# Altium schematic sheet Codec.SchDoc: Codec
size A4; DrawnBy: Brain-Yao; DocumentNumber: 2; Revision: 1.0; SheetNumber: 2; SheetTotal: 3; ProjectName: Stethoscope
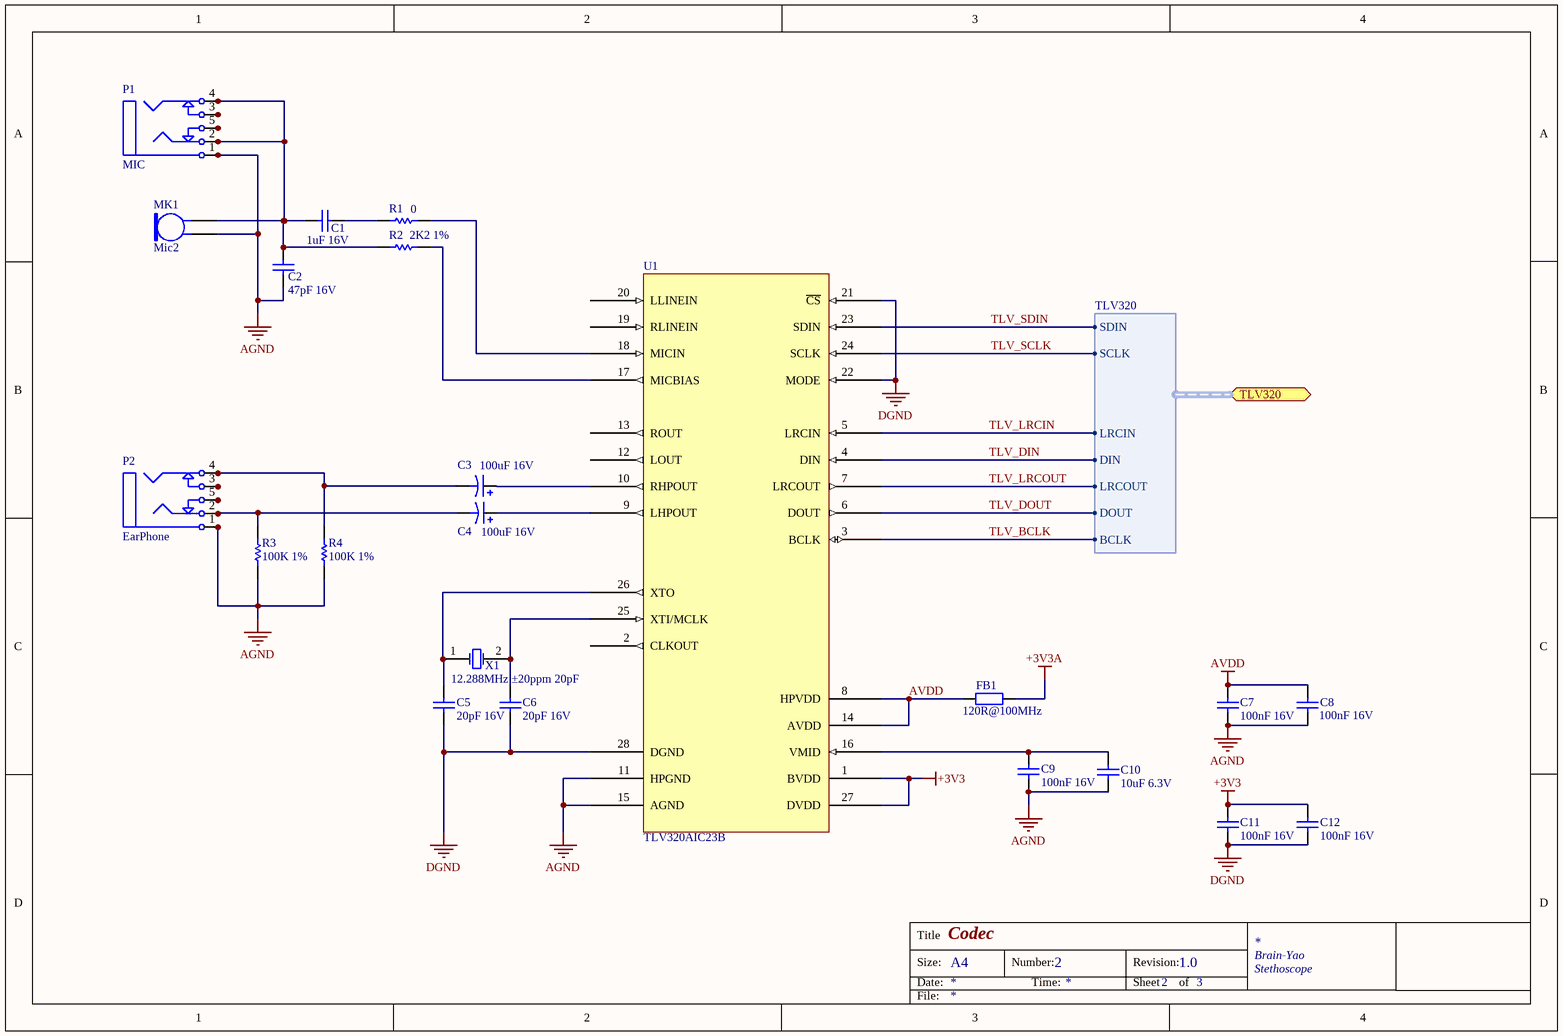
[diagram p0: Codec.SchDoc]

## Parts
C1  1uF 16V  [CAPC0603(1608)100_M]
C2  47pF 16V  [CAPC0603(1608)100_M]
C3  100uF 16V  [HONOR_63X54]
C4  100uF 16V  [HONOR_63X54]
C5  20pF 16V  [CAPC0603(1608)100_M]
C6  20pF 16V  [CAPC0603(1608)100_M]
C7  100nF 16V  [CAPC0603(1608)100_M]
C8  100nF 16V  [CAPC0603(1608)100_M]
C9  100nF 16V  [CAPC0603(1608)100_M]
C10  10uF 6.3V  [CAPC0603(1608)100_M]
C11  100nF 16V  [CAPC0603(1608)100_M]
C12  100nF 16V  [CAPC0603(1608)100_M]
FB1  120R@100MHz  [RESC1608N]
MK1  Mic2  [PIN2]
P1  MIC  [ST-3150-5N]
P2  EarPhone  [ST-3150-5N]
R1  0  [RESC0603(1608)_M]
R2  2K2 1%  [RESC0603(1608)_M]
R3  100K 1%  [RESC0603(1608)_M]
R4  100K 1%  [RESC0603(1608)_M]
U1  TLV320AIC23B  [PW28]
X1  12.288MHz ±20ppm 20pF  [49S]

## Ports
TLV320 (harness TLV320)

## Harnesses
TLV320: SDIN, SCLK, LRCOUT, DOUT, BCLK, DIN, LRCIN

## Nets
+3V3: C11.2 C12.2 U1.1(BVDD) U1.27(DVDD)
+3V3A: FB1.2
AGND: C2.1 C7.1 C8.1 C9.1 C10.1 MK1.2 P1.1 P1.1A P1.1B P2.1 P2.1A P2.1B R3.1 R4.1 U1.11(HPGND) U1.15(AGND)
AVDD: C7.2 C8.2 FB1.1 U1.8(HPVDD) U1.14(AVDD)
DGND: C5.1 C6.1 C11.1 C12.1 U1.21(~{CS}) U1.22(MODE) U1.28(DGND)
TLV_BCLK: U1.3(BCLK) ; port TLV320.BCLK
TLV_DIN: U1.4(DIN) ; port TLV320.DIN
TLV_DOUT: U1.6(DOUT) ; port TLV320.DOUT
TLV_LRCIN: U1.5(LRCIN) ; port TLV320.LRCIN
TLV_LRCOUT: U1.7(LRCOUT) ; port TLV320.LRCOUT
TLV_SCLK: U1.24(SCLK) ; port TLV320.SCLK
TLV_SDIN: U1.23(SDIN) ; port TLV320.SDIN
NetC1_1: C1.1 C2.2 MK1.1 P1.2 P1.2A P1.2B P1.4 P1.4A P1.4B R2.1
NetC1_2: C1.2 R1.1
NetC3_1: C3.1 U1.10(RHPOUT)
NetC3_2: C3.2 P2.4 P2.4A P2.4B R4.2
NetC4_1: C4.1 U1.9(LHPOUT)
NetC4_2: C4.2 P2.2 P2.2A P2.2B R3.2
NetC5_2: C5.2 U1.26(XTO) X1.1(OSC1)
NetC6_2: C6.2 U1.25(XTI/MCLK) X1.2(OSC2)
NetC9_2: C9.2 C10.2 U1.16(VMID)
NetP1_3: P1.3 P1.3A P1.3B
NetP1_5: P1.5 P1.5A P1.5B
NetP2_3: P2.3 P2.3A P2.3B
NetP2_5: P2.5 P2.5A P2.5B
NetR1_2: R1.2 U1.18(MICIN)
NetR2_2: R2.2 U1.17(MICBIAS)

Not connected (* = marked no-connect by the designer): U1 2(CLKOUT) 12(LOUT) 13(ROUT) 19(RLINEIN) 20(LLINEIN)

## Notes on the sheet
- Title
- Size:
- Date:
- A4
- Number:
- Time:
- Revision:
- Sheet
- of
- File:

## Library data of the parts
C1 = CMP-1035-02736-1: CAP 1uF 16V ±5% 0603 (1608 Metric) Thickness 1mm SMD; Case-Metric: 1608; Case-EIA: 0603; Technology: SMT; Max Thickness: 1 mm; Rated Voltage: 16 V; Value: 1uF; Tolerance: ±5%
C2 = CMP-1035-01051-1: CAP 47pF 16V ±5% 0603 (1608 Metric) Thickness 1mm SMD; Case-Metric: 1608; Case-EIA: 0603; Max Thickness: 1 mm; Value: 47pF; Technology: SMT; Tolerance: ±5%; Rated Voltage: 16 V
C3 C4 = Cap Pol1: Polarized Capacitor (Radial); Published: 8-Jun-2000; LatestRevisionDate: 17-Jul-2002; LatestRevisionNote: Re-released for DXP Platform.; PackageReference: RB7.6-15; Publisher: Altium Limited; PackageDescription: Polarized Capacitor (Radial); 2 Leads; Value: 100uF
C5 C6 = CMP-1035-00768-1: CAP 20pF 16V ±0.25pF 0603 (1608 Metric) Thickness 1mm SMD; Case-Metric: 1608; Case-EIA: 0603; Max Thickness: 1 mm; Value: 20pF; Technology: SMT; Rated Voltage: 16 V; Tolerance: ±0.25pF
C7-C9 C11 C12 = CMP-1035-02584-1: CAP 100nF 16V ±10% 0603 (1608 Metric) Thickness 1mm SMD; Case-EIA: 0603; Case-Metric: 1608; Tolerance: ±10%; Technology: SMT; Max Thickness: 1 mm; Value: 100nF; Rated Voltage: 16 V
C10 = CMP-1035-02796-1: CAP 10uF 6.3V ±10% 0603 (1608 Metric) Thickness 1mm SMD; Case-EIA: 0603; Case-Metric: 1608; Tolerance: ±10%; Value: 10uF; Technology: SMT; Rated Voltage: 6.3 V; Max Thickness: 1 mm
FB1 = Res2: Resistor; Published: 8-Jun-2000; LatestRevisionDate: 17-Jul-2002; LatestRevisionNote: Re-released for DXP Platform.; PackageReference: AXIAL-0.4; Publisher: Altium Limited; PackageDescription: Axial Device, Thru-Hole; 2 Leads; 0.4 in Pin Spacing; Value: 120R@100MHz
MK1 = Mic2: Microphone; Published: 24-Mar-1999; LatestRevisionDate: 17-Jul-2002; LatestRevisionNote: Re-released for DXP Platform.; PackageReference: PIN2; Publisher: Altium Limited
P1 P2 = Phonejack Stereo SW: 3-Conductor Jack with 2 break contacts (normals) and 2 auxiliary make contacts; Published: 5-Jan-2004; LatestRevisionDate: 17-Dec-2003; LatestRevisionNote: PCB Footprint replaced.; DatasheetDocument: 07-Mar-2000; Publisher: Altium Limited; ComponentLink1Description: Manufacturer Link; ComponentLink1URL: http://domino.kycon.com/internet/Products.html
R1 = CMP-1012-00001-1: Jumper 0603 (1608 Metric); Case-Metric: 1608; Value: 0.00 Ohm; Power: None; Case-EIA: 0603; Technology: SMT; Tolerance: None
R2 = CMP-1012-00546-1: 2K2 0.1W 1% 0603 (1608 Metric)  SMD; Case-EIA: 0603; Value: 2200.00 Ohm; Case-Metric: 1608; Tolerance: 1 %; Power: 0.1 W; Technology: SMT
R3 R4 = CMP-1012-00736-1: 100K 0.1W 1% 0603 (1608 Metric)  SMD; Value: 100000.00 Ohm; Case-Metric: 1608; Case-EIA: 0603; Power: 0.1 W; Tolerance: 1 %; Technology: SMT
U1 = TLV320AIC23B: Imported; Manufacturer_Part_Number: tlv320aic23b_pw_28; Vendor: Texas Instruments; PACKAGE_DESIGNATOR: PW; PIN_COUNT: 28; FAMILY_NAME: Audio CODEC; INDUSTRY_STD_PKG_TYPE: TSSOP; GENERIC_PART_NUMBER: TLV320AIC23B; Datasheet URL: http://www.ti.com/lit/gpn/TLV320AIC23B; Manufacturer: Texas Instruments; RefDes: RefDes; Type: DEV; Value: Value
X1 = XTAL: Crystal Oscillator; Published: 8-Jun-2000; LatestRevisionDate: 17-Jul-2002; LatestRevisionNote: Re-released for DXP Platform.; PackageReference: R38; Publisher: Altium Limited; PackageDescription: Crystal, Thru-Hole; 2 Leads; Body 3.1 x 8.2 mm (Dia.xH)